# Altium schematic sheet Power Supply Test.SchDoc
size A; SheetNumber: 14; SheetTotal: 19
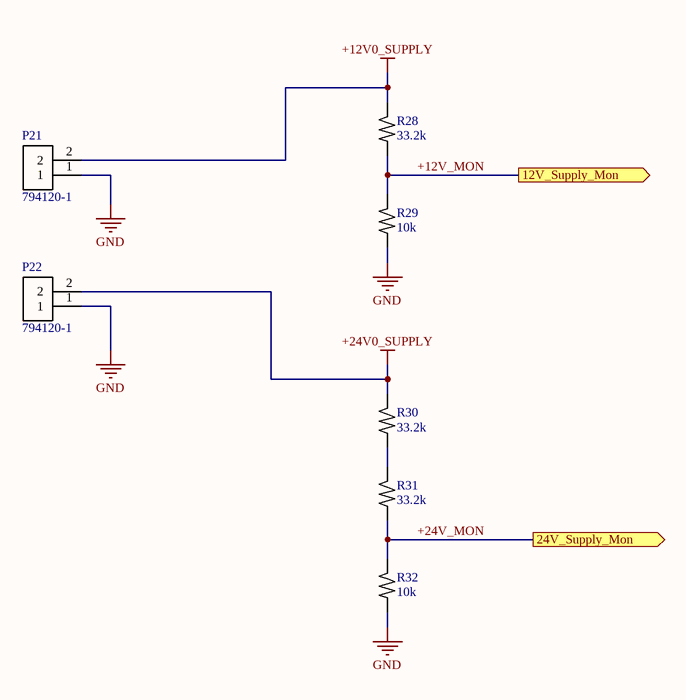
[diagram p0: Power Supply Test.SchDoc]

## Parts
P21  794120-1  [POWER2-5.08 right angle]
P22  794120-1  [POWER2-5.08 right angle]
R28  33.2k  [R0603]
R29  10k  [R0603]
R30  33.2k  [R0603]
R31  33.2k  [R0603]
R32  10k  [R0603]

## Ports
12V_Supply_Mon (out), 24V_Supply_Mon (out)

## Nets
+12V0_SUPPLY: P21.2 R28.2
+24V0_SUPPLY: P22.2 R30.2
GND: P21.1 P22.1 R29.1 R32.1
+12V_MON: R28.1 R29.2 ; port 12V_Supply_Mon
+24V_MON: R31.1 R32.2 ; port 24V_Supply_Mon
NetR30_1: R30.1 R31.2

## Notes on the sheet
- Project:
- Sheet Title:
- Size
- Date:
- A
- Sheet Number:
- Sheet Total:
- Revision:
- Time:
- Author:

## Library data of the parts
P21 P22 = Power2: PCB Mount Header, Right Angle, Wire-to-Board, 2 Position, 5.08 mm [.2 in] Centerline, Fully Shrouded, Pre-Tin, Commercial MATE-N-LOK; MP: TE Connectivity; MF: 794120-1; ComponentLink1Description: Datasheet; ComponentLink1URL: https://www.te.com/commerce/DocumentDelivery/DDEController?Action=srchrtrv&DocNm=114-1012&DocType=Specification%20Or%20Standard&DocLang=English&DocFormat=pdf&PartCntxt=794120-1; ComponentLink2Description: Supplier1
R28 R30 R31 = Res: RES 33.2kΩ ±1% 100mW 0603; MF: FOJAN; MP: FRC0603F3322TS; ComponentLink1Description: Datasheet; ComponentLink1URL: https://www.lcsc.com/datasheet/C2933200.pdf; ComponentLink2Description: Supplier1; ComponentLink2URL: https://www.lcsc.com/product-detail/C2933200.html
R29 R32 = Res: RES 10kΩ ±1% 100mW 0603; MF: FOJAN; MP: FRC0603F1002TS; ComponentLink1Description: Datasheet; ComponentLink1URL: https://www.lcsc.com/datasheet/C2906982.pdf; ComponentLink2Description: Supplier1; ComponentLink2URL: https://www.lcsc.com/product-detail/C2906982.html